# EAGLE schematic megashield_rs485 (EAGLE 7.3.0)
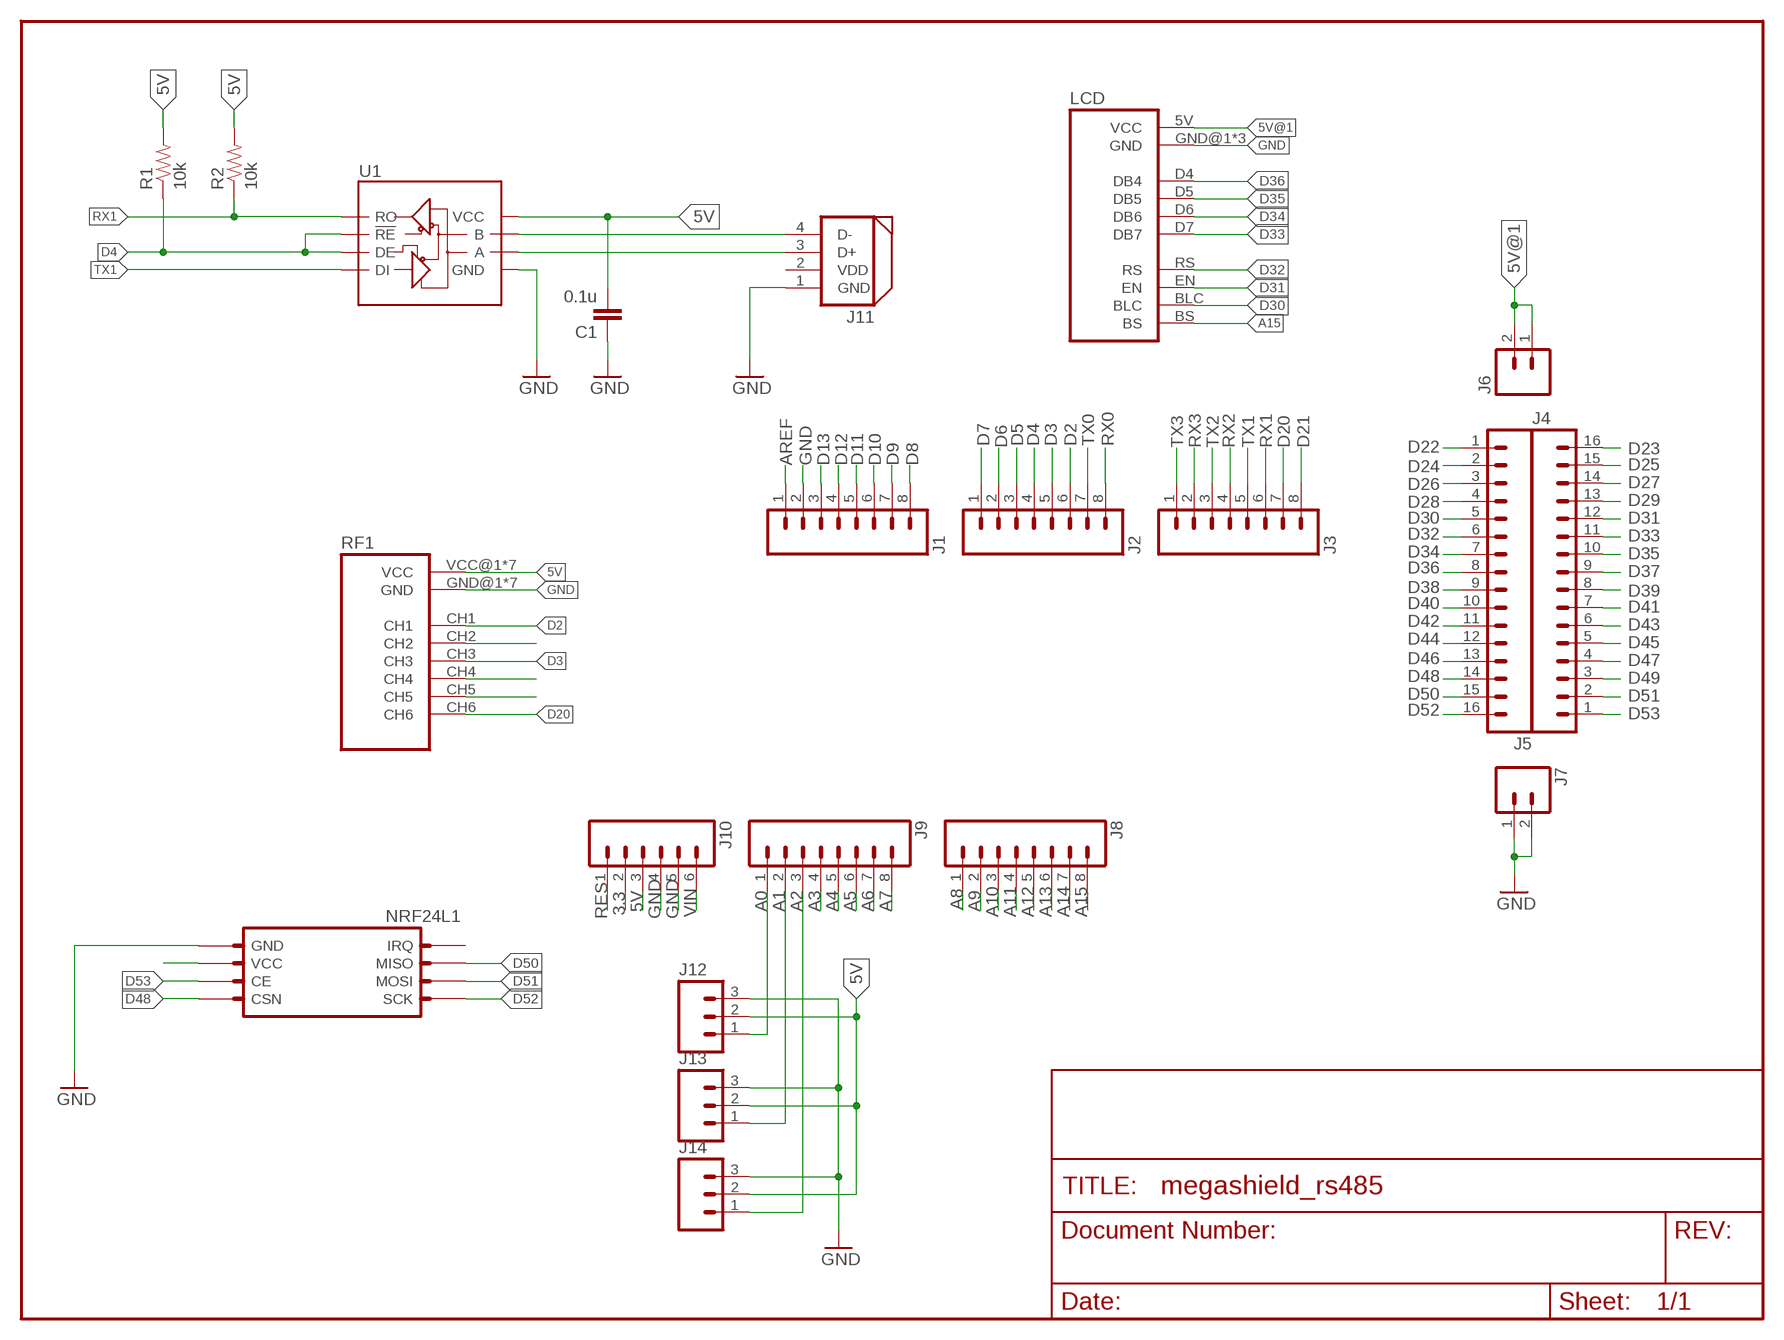
[diagram p0: schematic, sheet 1]

## Parts
C1  0.1u  CAPPTH  [CAP-PTH-SMALL]
J1  M08LONGPADS  [1X08_LONGPADS]
J2  M08LONGPADS  [1X08_LONGPADS]
J3  M08LONGPADS  [1X08_LONGPADS]
J4  M16PTH  [1X16]
J5  M16PTH  [1X16]
J6  M02PTH  [1X02]
J7  M02PTH  [1X02]
J8  M08LONGPADS  [1X08_LONGPADS]
J9  M08LONGPADS  [1X08_LONGPADS]
J10  M06LONGPADS  [1X06_LONGPADS]
J11  DYNAMIXEL_RS485  [DYNAMIXEL_SPOX_04]
J12  M03PTH  [1X03]
J13  M03PTH  [1X03]
J14  M03PTH  [1X03]
LCD  LCD_SHIELD  [LCD_SHIELD]
NRF24L1  NRF  [NRF]
R1  10k  RESISTORPTH-1/4W  [AXIAL-0.4]
R2  10k  RESISTORPTH-1/4W  [AXIAL-0.4]
RF1  FS_R6B  [FS_R6B]
U1  RS485  SN75176B  [DIL08]

## Nets
3.3: J10.2
5V: C1.2 J10.3 J12.2 J13.2 J14.2 R1.P$2 R2.P$2 RF1.VCC@1(VCC) RF1.VCC@2(VCC) RF1.VCC@3(VCC) RF1.VCC@4(VCC) RF1.VCC@5(VCC) RF1.VCC@6(VCC) RF1.VCC@7(VCC) U1.8(VCC)
5V@1: J6.1 J6.2 LCD.5V(VCC)
A0: J9.1 J12.1
A1: J9.2 J13.1
A2: J9.3 J14.1
A3: J9.4
A4: J9.5
A5: J9.6
A6: J9.7
A7: J9.8
A8: J8.1
A9: J8.2
A10: J8.3
A11: J8.4
A12: J8.5
A13: J8.6
A14: J8.7
A15: J8.8 LCD.BS
AREF: J1.1
D2: J2.6 RF1.CH1
D3: J2.5 RF1.CH3
D4: J2.4 R1.P$1 U1.2(!RE) U1.3(DE)
D5: J2.3
D6: J2.2
D7: J2.1
D8: J1.8
D9: J1.7
D10: J1.6
D11: J1.5
D12: J1.4
D13: J1.3
D20: J3.7 RF1.CH6
D21: J3.8
D22: J5.1
D23: J4.16
D24: J5.2
D25: J4.15
D26: J5.3
D27: J4.14
D28: J5.4
D29: J4.13
D30: J5.5 LCD.BLC
D31: J4.12 LCD.EN
D32: J5.6 LCD.RS
D33: J4.11 LCD.D7(DB7)
D34: J5.7 LCD.D6(DB6)
D35: J4.10 LCD.D5(DB5)
D36: J5.8 LCD.D4(DB4)
D37: J4.9
D38: J5.9
D39: J4.8
D40: J5.10
D41: J4.7
D42: J5.11
D43: J4.6
D44: J5.12
D45: J4.5
D46: J5.13
D47: J4.4
D48: J5.14 NRF24L1.4(CSN)
D49: J4.3
D50: J5.15 NRF24L1.7(MISO)
D51: J4.2 NRF24L1.6(MOSI)
D52: J5.16 NRF24L1.5(SCK)
D53: J4.1 NRF24L1.3(CE)
GND: C1.1 J1.2 J7.1 J7.2 J10.4 J10.5 J11.1(GND) J12.3 J13.3 J14.3 LCD.GND@1(GND) LCD.GND@2(GND) LCD.GND@3(GND) NRF24L1.P$1(GND) RF1.GND@1(GND) RF1.GND@2(GND) RF1.GND@3(GND) RF1.GND@4(GND) RF1.GND@5(GND) RF1.GND@6(GND) RF1.GND@7(GND) U1.5(GND)
N$1: J11.3(D+) U1.6(A)
N$2: J11.4(D-) U1.7(B)
N$4: RF1.CH2
N$6: RF1.CH4
N$7: RF1.CH5
N$10: NRF24L1.2(VCC)
RES: J10.1
RX0: J2.8
RX1: J3.6 R2.P$1 U1.1(RO)
RX2: J3.4
RX3: J3.2
TX0: J2.7
TX1: J3.5 U1.4(DI)
TX2: J3.3
TX3: J3.1
VIN: J10.6
Unconnected: NRF24L1.8(IRQ)

## Power pins joined to a net without a drawn wire
VDD: J11.2(VDD)

## Library data of the parts
C1 = mecatronica_eagle_lib:CAP: Capacitor Standard 0603 ceramic capacitor, and 0.1" leaded capacitor.
J1-J3 J8 J9 = mecatronica_eagle_lib:M08: Header 8 Standard 8-pin 0.1" header. Use with straight break away headers (SKU : PRT-00116), right angle break away headers (PRT-00553), swiss pins (PRT-00743), machine pins (PRT-00117), and female headers (PRT-00115).
J4 J5 = mecatronica_eagle_lib:M16: 1x16 .1" header
J6 J7 = mecatronica_eagle_lib:M02: Standard 2-pin 0.1" header. Use with - straight break away headers ( PRT-00116) - right angle break away headers (PRT-00553) - swiss pins (PRT-00743) - machine pins (PRT-00117) - female headers (PRT-00115) Molex polarized connector foot print use with: PRT-08233 with associated crimp pins and housings. 2.54_SCREWTERM for use with PRT-10571. 3.5mm Screw Terminal footprints for PRT-08084 5mm Screw Terminal footprints for use with PRT-08432
J10 = mecatronica_eagle_lib:M06: Header 6 Standard 6-pin 0.1" header. Use with straight break away headers (SKU : PRT-00116), right angle break away headers (PRT-00553), swiss pins (PRT-00743), machine pins (PRT-00117), and female headers (PRT-00115). Molex polarized connector foot print use with SKU : PRT-08094 with associated crimp pins and housings. NOTES ON THE VARIANTS LOCK and LOCK_LONGPADS... This footprint was designed to help hold the alignment of a through-hole component (i.e. 6-pin header) while soldering it into place. You may notice that each hole has been shifted either up or down by 0.005 of an inch from it's more standard position (which is a perfectly straight line). This slight alteration caused the pins (the squares in the middle) to touch the edges of the holes. Because they are alternating, it causes a "brace" to hold the component in place. 0.005 has proven to be the perfect amount of "off-center" position when using our standard breakaway headers. Although looks a little odd when you look at the bare footprint, once you have a header in there, the alteration is very hard to notice. Also,if you push a header all the way into place, it is covered up entirely on the bottom side. This idea of altering the position of holes to aid alignment will be further integrated into the Sparkfun Library for other footprints. It can help hold any component with 3 or more connection pins.
J11 = mecatronica_eagle_lib:DYNAMIXEL_RS485: Dynamixel RS-485 Connector Molex LLC SPOX 4 Male connector Digikey code: WM18888-ND
J12-J14 = mecatronica_eagle_lib:M03: Header 3 Standard 3-pin 0.1" header. Use with straight break away headers (SKU : PRT-00116), right angle break away headers (PRT-00553), swiss pins (PRT-00743), machine pins (PRT-00117), and female headers (PRT-00115). Molex polarized connector foot print use with SKU : PRT-08232 with associated crimp pins and housings.
LCD = mecatronica_eagle_lib:LCD_SHIELD: LCD Shield
NRF24L1 = mecatronica_eagle_lib:NRF: nRF24L01 Module
R1 R2 = mecatronica_eagle_lib:RESISTOR: Resistor Basic schematic elements and footprints for 0603, 1206, and PTH resistors.
RF1 = mecatronica_eagle_lib:FS_R6B: FS-R6B 6 channels 2.4GHz digital receiver system
U1 = mecatronica_eagle_lib:SN75176B: SN75176B Datasheet: http://www.ti.com/lit/ds/symlink/sn75176b.pdf